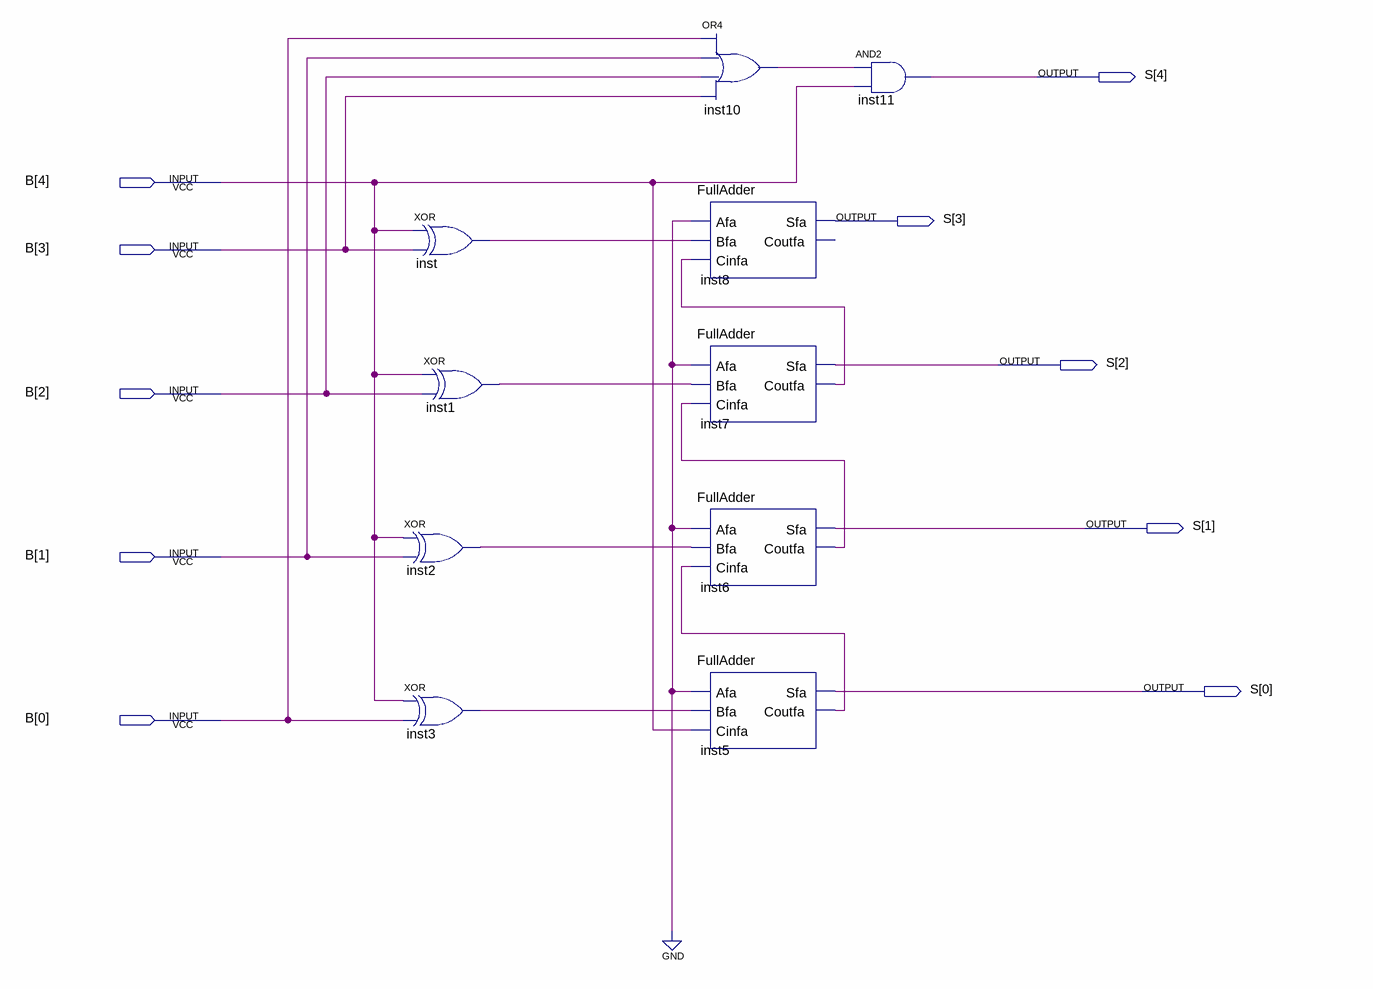
[diagram p0: schematic sheet]
// Quartus schematic TwosComplement5Bits.bdf as structural Verilog: 10 symbols, 10 pins
module TwosComplement5Bits (
  input  [4:0] B,
  output [4:0] S
);

  wire inst1_out, inst2_out, inst3_out, inst5_coutfa, inst6_coutfa, inst7_coutfa, inst10_out, inst_out;

  xor inst (inst_out, B[4], B[3]);
  xor inst1 (inst1_out, B[4], B[2]);
  xor inst2 (inst2_out, B[4], B[1]);
  xor inst3 (inst3_out, B[4], B[0]);
  FullAdder inst8 (.Afa(1'b0), .Bfa(inst_out), .Cinfa(inst7_coutfa), .Sfa(S[3]));  // open: Coutfa
  FullAdder inst7 (.Afa(1'b0), .Bfa(inst1_out), .Cinfa(inst6_coutfa), .Sfa(S[2]), .Coutfa(inst7_coutfa));
  FullAdder inst6 (.Afa(1'b0), .Bfa(inst2_out), .Cinfa(inst5_coutfa), .Sfa(S[1]), .Coutfa(inst6_coutfa));
  FullAdder inst5 (.Afa(1'b0), .Bfa(inst3_out), .Cinfa(B[4]), .Sfa(S[0]), .Coutfa(inst5_coutfa));
  or inst10 (inst10_out, B[0], B[1], B[2], B[3]);
  and inst11 (S[4], inst10_out, B[4]);
endmodule
